# Altium schematic sheet M1-MCU.SchDoc
size A3; ApprovedBy: -; CheckedBy: h.t.t.monfared; Author: h.t.t.monfared; Engineer: h.t.t.monfared; Revision: 1.0; SheetNumber: 2; SheetTotal: 9; Project Code:: UFM Sensor Controller; Document Title:: MCU Sheet
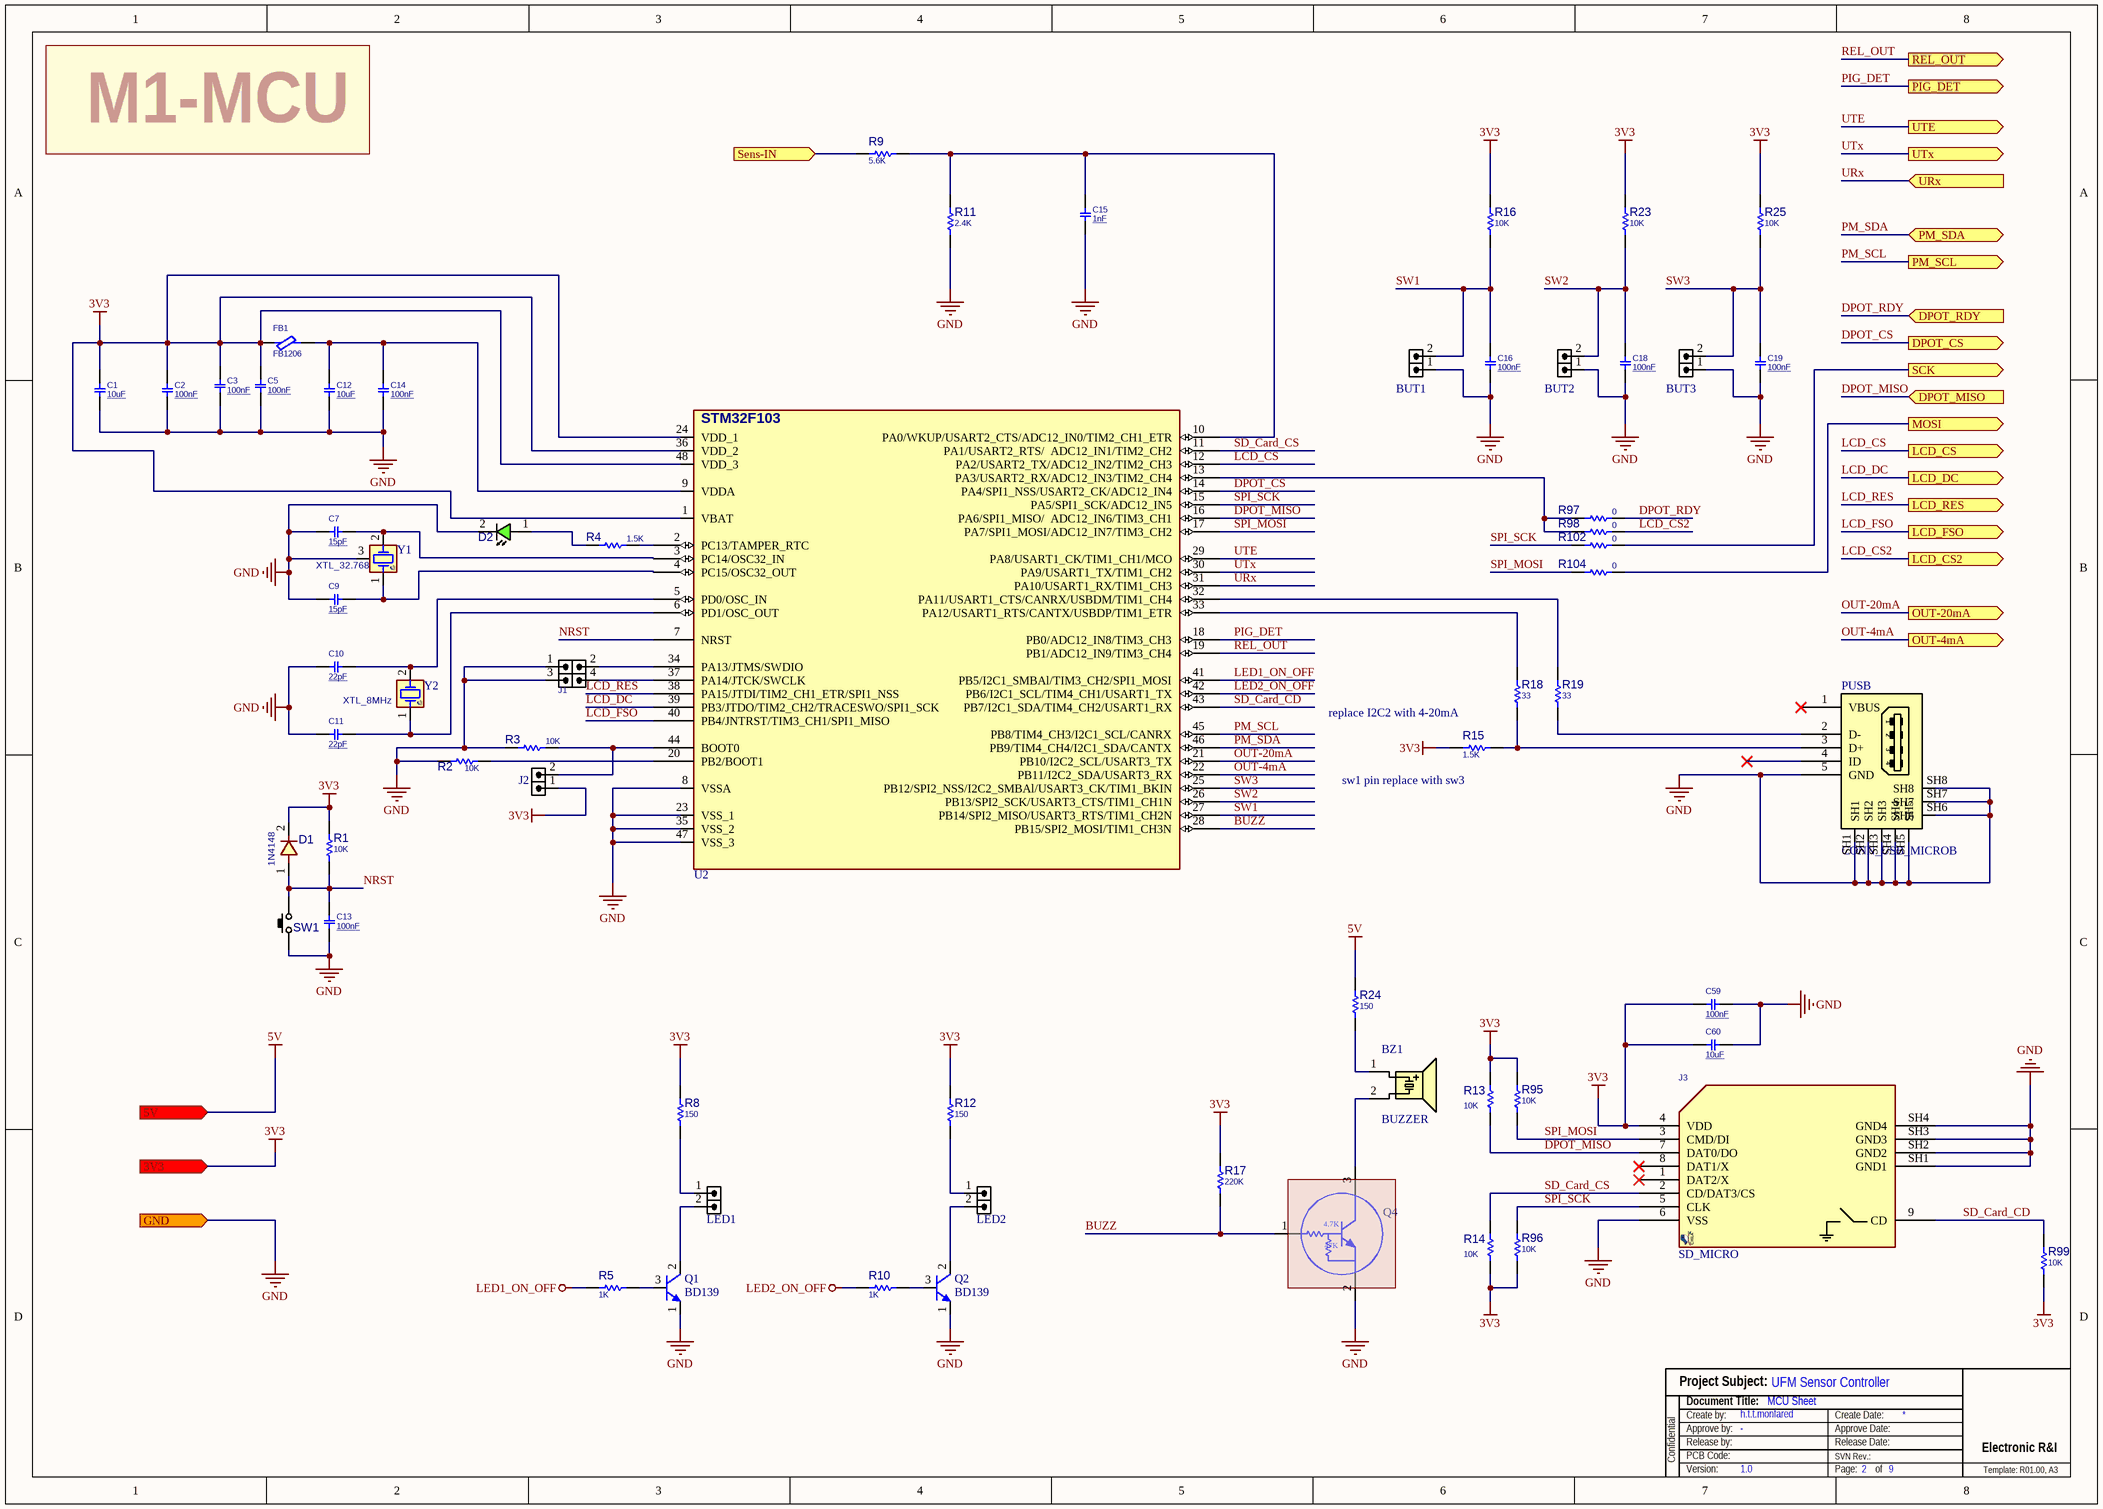
[diagram p0: M1-MCU.SchDoc]

## Parts
BUT1  HDRM2  [TMS2]  (value not drawn)
BUT2  HDRM2  [TMS2]  (value not drawn)
BUT3  HDRM2  [TMS2]  (value not drawn)
BZ1  BUZZER  [BZ_C12]
C1  10uF  [C1206]
C2  100nF  [C1206]
C3  100nF  [C1206]
C5  100nF  [C1206]
C7  15pF  [C1206]
C9  15pF  [C1206]
C10  22pF  [C1206]
C11  22pF  [C1206]
C12  10uF  [C1206]
C13  100nF  [C1206]
C14  100nF  [C1206]
C15  1nF  [C1206]
C16  100nF  [C1206]
C18  100nF  [C1206]
C19  100nF  [C1206]
C59  100nF  [C1206]
C60  10uF  [C1206]
D1  1N4148  [D_AX02_DO35]
D2  LED1206GRN  [LED1206GRN]  (value not drawn)
FB1  FB1206  [L1206]
J1  HDRM_2X2  [HDR_M_2X2]  (value not drawn)
J2  HDRM2  [HDR_M_1X2]  (value not drawn)
J3  SD_MICRO  [SDMICRO_AT]
LED1  HDRM2  [TMS2]  (value not drawn)
LED2  HDRM2  [TMS2]  (value not drawn)
PUSB  CONN_USB_MICROB  [USB_MICRO_B_BM_SHS]
Q1  BD139  [TO126_3]
Q2  BD139  [TO126_3]
Q4  BCR116  [SOT23]  (value not drawn)
R1  10K  [R1206]
R2  10K  [R1206]
R3  10K  [R1206]
R4  1.5K  [R1206]
R5  1K  [R1206]
R8  150  [R1206]
R9  5.6K  [R1206]
R10  1K  [R1206]
R11  2.4K  [R1206]
R12  150  [R1206]
R13  10K  [R1206]
R14  10K  [R1206]
R15  1.5K  [R1206]
R16  10K  [R1206]
R17  220K  [R1206]
R18  33  [R1206]
R19  33  [R1206]
R23  10K  [R1206]
R24  150  [R1206]
R25  10K  [R1206]
R95  10K  [R1206]
R96  10K  [R1206]
R97  0  [R1206]
R98  0  [R1206]
R99  10K  [R1206]
R102  0  [R1206]
R104  0  [R1206]
SW1  PUSHBUTTON  [SWPBS_SPST_6X3X5]  (value not drawn)
U2  STM32F103  [QFG50_48]  (value not drawn)
Y1  XTL_32.768  [XTLT_RTC]
Y2  XTL_8MHz  [XTL_2_11X5]

## Ports
3V3 (in), 5V (in), DPOT_CS (out), DPOT_MISO (in), DPOT_RDY (in), GND (in), LCD_CS2 (out), LCD_CS (out), LCD_DC (out), LCD_FSO (out), LCD_RES (out), MOSI (out), OUT-4mA (out), OUT-20mA (out), PIG_DET (out), PM_SCL (out), PM_SDA (bidir), REL_OUT (out), SCK (out), Sens-IN (in), URx (in), UTE (out), UTx (out)

## Nets
3V3: C1.2 C2.2 C3.2 C5.2 C59.1 C60.1 D1.2 FB1.1 J2.1 J3.4(VDD) R1.2 R8.2 R12.2 R13.2 R14.1 R15.1 R16.2 R17.2 R23.2 R25.2 R95.2 R96.1 R99.1 U2.1(VBAT) U2.24(VDD_1) U2.36(VDD_2) U2.48(VDD_3) ; port 3V3
5V: R24.2 ; port 5V
GND: BUT1.1 BUT2.1 BUT3.1 C1.1 C2.1 C3.1 C5.1 C7.1 C9.1 C10.1 C11.1 C12.2 C13.1 C14.1 C15.1 C16.1 C18.1 C19.1 C59.2 C60.2 D2.2(CATHODE) J1.1 J1.3 J3.6(VSS) J3.SH1(GND1) J3.SH2(GND2) J3.SH3(GND3) J3.SH4(GND4) PUSB.5(GND) PUSB.SH1 PUSB.SH2 PUSB.SH3 PUSB.SH4 PUSB.SH5 PUSB.SH6 PUSB.SH7 PUSB.SH8 Q1.1(E) Q2.1(E) Q4.2(E) R2.1 R3.1 R11.1 SW1.1(P1) U2.8(VSSA) U2.23(VSS_1) U2.35(VSS_2) U2.47(VSS_3) Y1.3(CASE) ; port GND
LED1_ON_OFF: R5.1 U2.41(PB5/I2C1_SMBAl/TIM3_CH2/SPI1_MOSI)
LED2_ON_OFF: R10.1 U2.42(PB6/I2C1_SCL/TIM4_CH1/USART1_TX)
BUZZ: Q4.1(B) R17.1 U2.28(PB15/SPI2_MOSI/TIM1_CH3N)
DPOT_CS: U2.14(PA4/SPI1_NSS/USART2_CK/ADC12_IN4) ; port DPOT_CS
DPOT_MISO: J3.7(DAT0/DO) R13.1 U2.16(PA6/SPI1_MISO/__ADC12_IN6/TIM3_CH1) ; port DPOT_MISO
DPOT_RDY: R97.2 ; port DPOT_RDY
LCD_CS: U2.12(PA2/USART2_TX/ADC12_IN2/TIM2_CH3) ; port LCD_CS
LCD_CS2: R98.2 ; port LCD_CS2
LCD_DC: U2.39(PB3/JTDO/TIM2_CH2/TRACESWO/SPI1_SCK) ; port LCD_DC
LCD_FSO: U2.40(PB4/JNTRST/TIM3_CH1/SPI1_MISO) ; port LCD_FSO
LCD_RES: U2.38(PA15/JTDI/TIM2_CH1_ETR/SPI1_NSS) ; port LCD_RES
MOSI: R104.2 ; port MOSI
NRST: C13.2 D1.1 R1.1 SW1.2(P3) U2.7(NRST)
OUT-4mA: U2.22(PB11/I2C2_SDA/USART3_RX) ; port OUT-4mA
OUT-20mA: U2.21(PB10/I2C2_SCL/USART3_TX) ; port OUT-20mA
PIG_DET: U2.18(PB0/ADC12_IN8/TIM3_CH3) ; port PIG_DET
PM_SCL: U2.45(PB8/TIM4_CH3/I2C1_SCL/CANRX) ; port PM_SCL
PM_SDA: U2.46(PB9/TIM4_CH4/I2C1_SDA/CANTX) ; port PM_SDA
REL_OUT: U2.19(PB1/ADC12_IN9/TIM3_CH4) ; port REL_OUT
SCK: R102.2 ; port SCK
SD_Card_CD: J3.9(CD) R99.2 U2.43(PB7/I2C1_SDA/TIM4_CH2/USART1_RX)
SD_Card_CS: J3.2(CD/DAT3/CS) R14.2 U2.11(PA1/USART2_RTS/__ADC12_IN1/TIM2_CH2)
Sens-IN: R9.1 ; port Sens-IN
SPI_MOSI: J3.3(CMD/DI) R95.1 R104.1 U2.17(PA7/SPI1_MOSI/ADC12_IN7/TIM3_CH2)
SPI_SCK: J3.5(CLK) R96.2 R102.1 U2.15(PA5/SPI1_SCK/ADC12_IN5)
SW1: BUT1.2 C16.2 R16.1 U2.27(PB14/SPI2_MISO/USART3_RTS/TIM1_CH2N)
SW2: BUT2.2 C18.2 R23.1 U2.26(PB13/SPI2_SCK/USART3_CTS/TIM1_CH1N)
SW3: BUT3.2 C19.2 R25.1 U2.25(PB12/SPI2_NSS/I2C2_SMBAl/USART3_CK/TIM1_BKIN)
URx: U2.31(PA10/USART1_RX/TIM1_CH3) ; port URx
UTE: U2.29(PA8/USART1_CK/TIM1_CH1/MCO) ; port UTE
UTx: U2.30(PA9/USART1_TX/TIM1_CH2) ; port UTx
NetBZ1_1: BZ1.1(A) R24.1
NetBZ1_2: BZ1.2(B) Q4.3(C)
NetC7_2: C7.2 U2.3(PC14/OSC32_IN) Y1.2(OSC2)
NetC9_2: C9.2 U2.4(PC15/OSC32_OUT) Y1.1(OSC1)
NetC10_2: C10.2 U2.5(PD0/OSC_IN) Y2.2(OSC2)
NetC11_2: C11.2 U2.6(PD1/OSC_OUT) Y2.1(OSC1)
NetC12_1: C12.1 C14.2 FB1.2 U2.9(VDDA)
NetC15_2: C15.2 R9.2 R11.2 U2.10(PA0/WKUP/USART2_CTS/ADC12_IN0/TIM2_CH1_ETR)
NetD2_1: D2.1(ANODE) R4.1
NetJ1_2: J1.2 U2.34(PA13/JTMS/SWDIO)
NetJ1_4: J1.4 U2.37(PA14/JTCK/SWCLK)
NetJ2_2: J2.2 R3.2 U2.44(BOOT0)
NetLED1_1: LED1.1 R8.1
NetLED1_2: LED1.2 Q1.2(C)
NetLED2_1: LED2.1 R12.1
NetLED2_2: LED2.2 Q2.2(C)
NetPUSB_2: PUSB.2(D-) R19.1
NetPUSB_3: PUSB.3(D+) R15.2 R18.1
NetQ1_3: Q1.3(B) R5.2
NetQ2_3: Q2.3(B) R10.2
NetR2_2: R2.2 U2.20(PB2/BOOT1)
NetR4_2: R4.2 U2.2(PC13/TAMPER_RTC)
NetR18_2: R18.2 U2.33(PA12/USART1_RTS/CANTX/USBDP/TIM1_ETR)
NetR19_2: R19.2 U2.32(PA11/USART1_CTS/CANRX/USBDM/TIM1_CH4)
NetR97_1: R97.1 R98.1 U2.13(PA3/USART2_RX/ADC12_IN3/TIM2_CH4)

Not connected (* = marked no-connect by the designer): J3 1(DAT2/X)* 8(DAT1/X)*; PUSB 1(VBUS)* 4(ID)*

## Notes on the sheet
- M1-MCU
- replace I2C2 with 4-20mA
- (near R15) sw1 pin replace with sw3
- Project Subject:
- Confidential
- Release by:
- Document Title:
- Create by:
- PCB Code:
- Approve by:
- SVN Rev.:
- Create Date:
- Release Date:
- Approve Date:
- Electronic R&I
- Version:
- Page:
- of
- Template: R01.00, A3
- (in symbol BCR116) 4.7K; 47K

## Library data of the parts
BUT1-BUT3 J2 LED1 LED2 = HDR_M_1X2: CONN, HEADER, Male, pitch: 2.54mm, 2POS; VALUE: HDRM2
BZ1 = BUZZER_C12: Buzzer, 12X8.5mm, Magnetic Transducer; MANF: Buerklin, CUI; MANF_P#: CM12P, MT03-H1BHP, BMT1205XH7.5, CEM-1201(50); PARAM2: 3~7VCC; PARAM: 2048 ±200 Hz; PRICE: PRICE; VALUE: BUZZER
C1-C3 C5 C7 C9-C16 C18 C19 C59 C60 = CAP_SMD_MLCC: CAP, MLCC, 1nF, 50V, C0G, 10%, 0402; MANF_P#: MANF_PART#; MANF: Murata; PRICE: 100= 1$; DESC: CAP, MLCC, 1nF, 50V, C0G, 10%, 0402; ASSEMBLY: ASSEMBLY
  C1 C12 C60: PARAM: C0G, 10%; PARAM2: 50V; VALUE: 10uF
  C2 C3 C5 C13 C14: PARAM: 50V; PARAM2: C0G, 10%; VALUE: 100nF
  C7 C9: PARAM: 50V; PARAM2: C0G, 10%; VALUE: 15pF
  C10 C11: PARAM: 50V; PARAM2: C0G, 10%; VALUE: 22pF
  C15: PARAM: C0G, 10%; PARAM2: 50V; VALUE: 1nF
  C16 C18 C19 C59: PARAM: C0G, 10%; PARAM2: 50V; VALUE: 100nF
D1 = DIODE_THD_1N4148_DO35: DIODE, FAST SWTICHING, THD; DESC: DESCRIPTION; PARAM: 75V; PARAM2: 0.3A; MANF: MANF; ASSEMBLY: ASSEMBLY; PRICE: PRICE; MANF_P#: 1N4148; VALUE: 1N4148
D2 = LED_SMD_1206_GRN: LED, SMD, 1206, GREEN; PARAM: 20mA; DESC: DESCRIPTION; PARAM2: 2.2V; MANF: -; ASSEMBLY: ASSEMBLY; PRICE: 36t@Javan; MANF_P#: -; VALUE: LED1206GRN
FB1 = FBEAD_SMD_BLM31PG330: FERRITE_Bead, 1206, 6A, 9mOhm, 33@100MHz; MANF: Murata; MANF_P#: BLM31PG330SN1L; PARAM: 33@100MHz; PARAM2: 6A, 9mOhm; VALUE: FB1206
J1 = HDR_M_2X2: CONN, HEADER, Male, pitch: 2.54mm, 4POS; MANF_P#: MANF_PART#; MANF: MANF; VALUE: HDRM_2X2
J3 = SOCKET_SDMICRO_AT: SD MICRO exist in Iran, Attend 112J-TDAR-R01; PARAM: push-push; MANF: Attend; MANF_P#: 112J-TDAR-R01; VALUE: SD_MICRO
PUSB = CONN_USB_MICRO_B_BM_SHS: CONN, USB, MICRO B, R/A, SMD, BOTTOM MOUNT; MANF_P#: 47346-0001; MANF: Molex; MANF_P#2: HIROSE ZX62-AB-5PA; PARAM2: 30VAC; PARAM: 1.8A, -20~85oC; PRICE: 0.75$; VALUE: CONN_USB_MICROB
Q1 Q2 = NPN_BD139_TO126: BJT, NPN, 80V, 1.5A; MANF: FAIRCHILD; VALUE: BD139; MANF_P#: BD139
Q4 = BCR116: NPN Silicon Digital Transistor
R1-R4 R8 R12 R15 R18 R19 = RES_SMD: RESISTOR, SMD; MANF_P#: RK73H1ETTP4701F; MANF: KOA SPEER; PARAM: 0.063W; DESC: DESCRIPTION; DIST#: MOUSER; PARAM2: 1%; ASSEMBLY: ASSEMBLY; PRICE: 100= 0.5$
  R1-R3: VALUE: 10K
  R4 R15: VALUE: 1.5K
  R8 R12: VALUE: 150
  R18 R19: VALUE: 33
R5 R10 = RES_SMD: RESISTOR, SMD; MANF_P#: RK73H1ETTP4701F; MANF: KOA SPEER; PARAM: 0.063W; DESC: DESCRIPTION; DIST#: MOUSER; PARAM2: 10%; ASSEMBLY: ASSEMBLY; PRICE: 100= 0.5$; VALUE: 1K
R9 R11 R13 R14 R16 R17 R23-R25 R95-R99 R102 R104 = RES_SMD: RESISTOR, SMD; PARAM: -W; DESC: DESCRIPTION; DIST#: MOUSER; PARAM2: 1%; MANF_P#: -; MANF: -; ASSEMBLY: ASSEMBLY; PRICE: 100= 0.5$
  R9: VALUE: 5.6K
  R11: VALUE: 2.4K
  R13 R14 R16 R23 R25 R95 R96 R99: VALUE: 10K
  R17: VALUE: 220K
  R24: VALUE: 150
  R97 R98 R102 R104: VALUE: 0
SW1 = SWPBS_SPST_6X3X4: SWITCH, PUSH BUTTON, TACTILE, SMD, SPST, 6X3.5X4.3mm; MANF: Panasonic; DESC: DESCRIPTION; MANF_P#: EVQ-PNF04M; VALUE: PUSHBUTTON; ASSEMBLY: ASSEMBLY; PARAM: PARAM; PRICE: PRICE
U2 = STM32F103C8T6_QFP48: MCU, STM32 ARM 32-bit, Cortex M3, 64KB FLASH, 20KB SRAM; DESC: CAN, I2C, SPI, USART, USB; MANF: ST; PARAM2: 2~3.6VCC, 72MHz, 2X12Bit ADC; PARAM: 64KB FLASH, 20KB SRAM, -40~85oC; MANF_P#: STM32F103C8T6; PRICE: 6$; VALUE: STM32F103
Y1 = XTL_3_32.768_THD: Crystal MOST POPULAR PACKAGE; MANF: ABRACON; MANF_P#: AB26T-32.768KHZ; PARAM2: 12pF; PARAM: 20PPM, -40~85°C; VALUE: XTL_32.768
Y2 = XTL_2_HC49_8MHz_SMD: Crystal MOST POPULAR ABL HC49 PACKAGE; MANF: ABRACON; MANF_P#: ABLS-8.000MHZ-B4-T; PARAM: 8MHz, 18pF, 30PPM, -20~70oC; PRICE: 0.3$; VALUE: XTL_8MHz